# Altium schematic sheet [2]-BLOCK_DIAGRAM.SchDoc
size A4
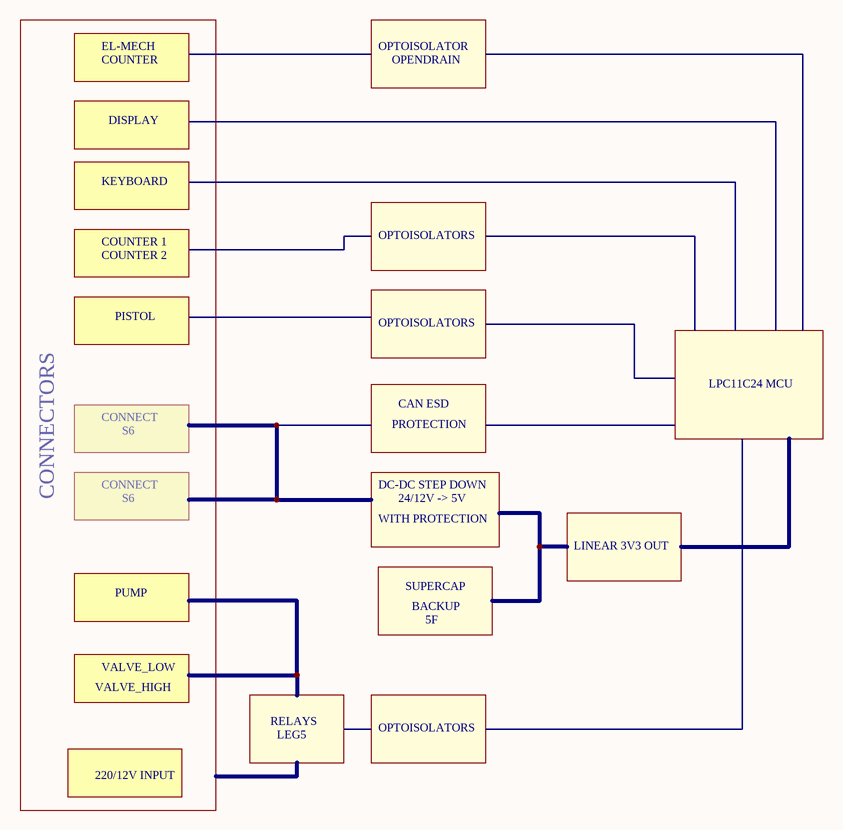
[diagram p0: [2]-BLOCK_DIAGRAM.SchDoc]

## Notes on the sheet
- EL-MECH
- COUNTER
- OPTOISOLATOR
- OPENDRAIN
- DISPLAY
- COUNTER 1
- KEYBOARD
- OPTOISOLATORS
- COUNTER 2
- PISTOL
- CONNECT
- S6
- PROTECTION
- CAN ESD
- LPC11C24 MCU
- CONNECTORS
- DC-DC STEP DOWN
- 24/12V -> 5V
- WITH PROTECTION
- LINEAR 3V3 OUT
- PUMP
- SUPERCAP
- BACKUP
- 5F
- VALVE_HIGH
- VALVE_LOW
- 220/12V INPUT
- RELAYS
- LEG5